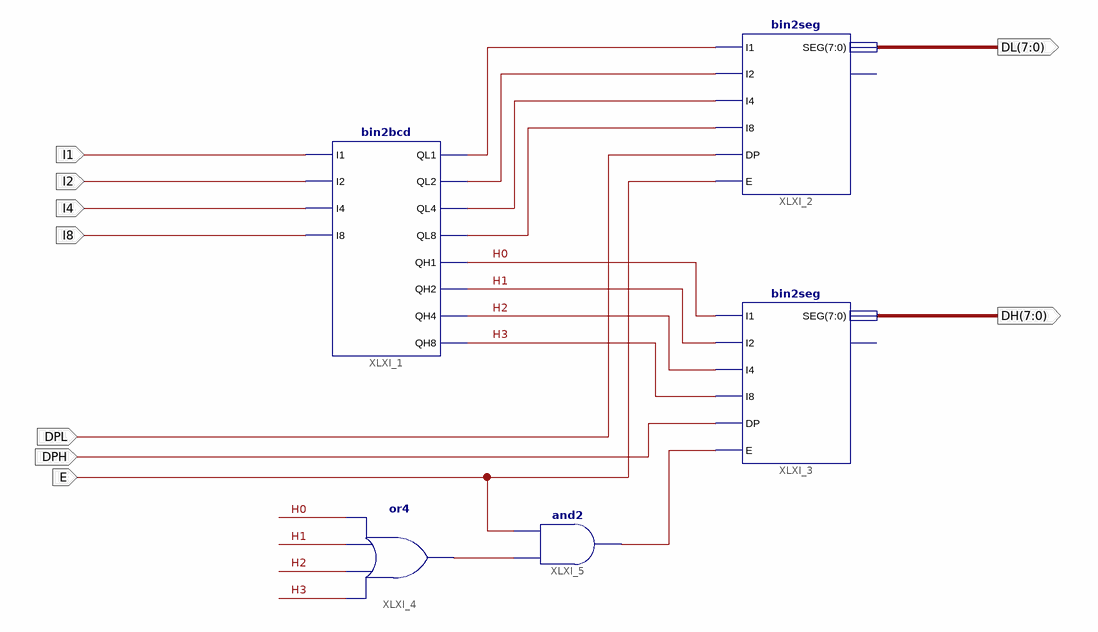
[diagram p0: schematic sheet 1]
// Xilinx ISE schematic bin2dseg.sch (spartan3e) as structural Verilog: 5 symbols, 9 ports
module bin2dseg (
  input  DPL,
  input  DPH,
  input  E,
  input  I8,
  input  I4,
  input  I2,
  input  I1,
  output [7:0] DL,
  output [7:0] DH
);

  wire H0, H1, H2, H3, XLXN_3, XLXN_9, XLXN_10, XLXN_11, XLXN_12, XLXN_18;

  bin2bcd XLXI_1 (
    .I1(I1), .I2(I2), .I4(I4), .I8(I8), .QH1(H0), .QH2(H1), .QH4(H2), .QH8(H3), .QL1(XLXN_9), .QL2(XLXN_10),
    .QL4(XLXN_11), .QL8(XLXN_12));
  bin2seg XLXI_2 (.DP(DPL), .E(E), .I1(XLXN_9), .I2(XLXN_10), .I4(XLXN_11), .I8(XLXN_12), .SEG(DL));  // open: NZ
  bin2seg XLXI_3 (.DP(DPH), .E(XLXN_18), .I1(H0), .I2(H1), .I4(H2), .I8(H3), .SEG(DH));  // open: NZ
  or XLXI_4 (XLXN_3, H3, H2, H1, H0);
  and XLXI_5 (XLXN_18, XLXN_3, E);
endmodule
